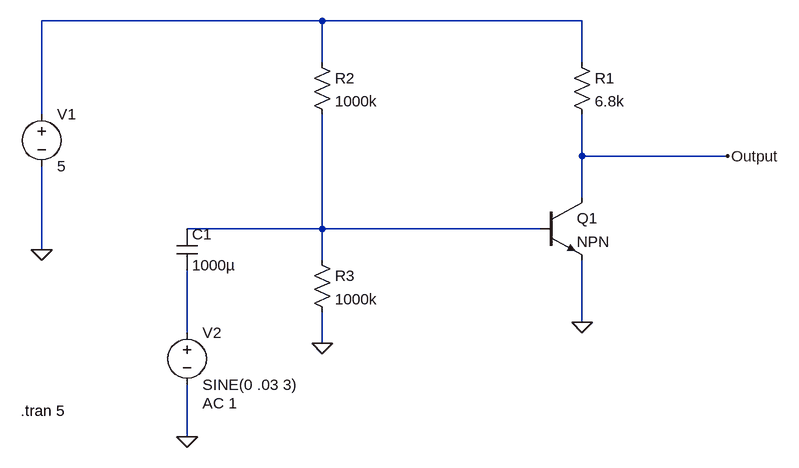
[diagram p0: schematic Draft1.asc]
Draft1.asc, the LTspice schematic file:
Version 4.1
SHEET 1 880 680
WIRE -144 -128 -576 -128
WIRE 256 -128 -144 -128
WIRE -144 -64 -144 -128
WIRE 256 -64 256 -128
WIRE -576 16 -576 -128
WIRE 256 80 256 16
WIRE 480 80 256 80
WIRE 256 144 256 80
WIRE -144 192 -144 16
WIRE -144 192 -352 192
WIRE 192 192 -144 192
WIRE -576 224 -576 96
WIRE -144 240 -144 192
WIRE 256 336 256 240
WIRE -352 352 -352 256
WIRE -144 368 -144 320
WIRE -352 512 -352 432
FLAG -576 224 0
FLAG 480 80 Output
FLAG -144 368 0
FLAG -352 512 0
FLAG 256 336 0
SYMBOL npn 192 144 R0
SYMATTR InstName Q1
SYMBOL voltage -576 0 R0
WINDOW 123 0 0 Left 0
WINDOW 39 0 0 Left 0
SYMATTR InstName V1
SYMATTR Value 5
SYMBOL res 240 -80 R0
SYMATTR InstName R1
SYMATTR Value 6.8k
SYMBOL res -160 -80 R0
SYMATTR InstName R2
SYMATTR Value 1000k
SYMBOL cap -368 192 R0
SYMATTR InstName C1
SYMATTR Value 1000µ
SYMBOL res -160 224 R0
SYMATTR InstName R3
SYMATTR Value 1000k
SYMBOL voltage -352 336 R0
WINDOW 123 24 124 Left 2
WINDOW 39 0 0 Left 0
SYMATTR Value2 AC 1
SYMATTR InstName V2
SYMATTR Value SINE(0 .03 3)
TEXT -608 472 Left 2 !.tran 5

The netlist it stands for:
* Draft1.asc
Q1 Output N002 0 0 NPN
V1 N001 0 5
R1 N001 Output 6.8k
R2 N001 N002 1000k
C1 N002 N003 1000µ
R3 N002 0 1000k
V2 N003 0 SINE(0 .03 3) AC 1
.model NPN NPN
.model PNP PNP
.lib standard.bjt
.tran 5
.backanno
.end